# Altium project in3ator.PrjPcb
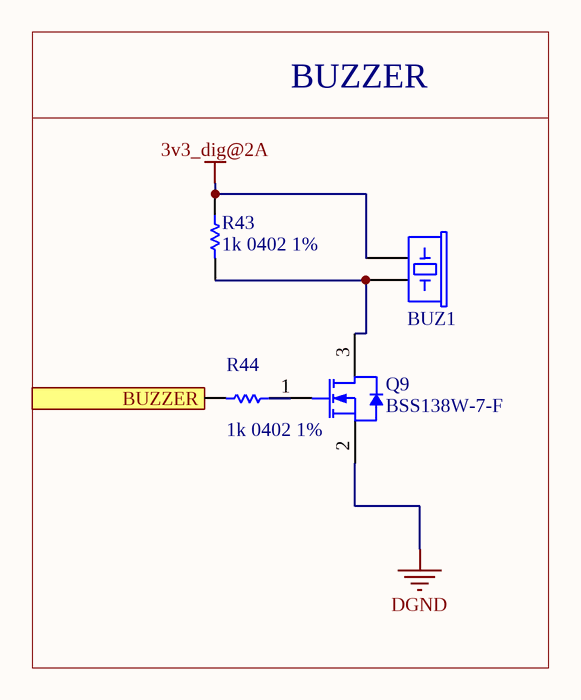
[diagram p0: Buzzer.SchDoc]
Author_in3: Pablo Sanchez Bergasa; SheetTotal_in3: 10
2 sheets, 25 parts. Net scope: flat (ports and power ports of the same name join across sheets).
Board file: Motherboard.PcbDoc
Sheets:
  Buzzer.SchDoc
  Sensors.SchDoc

## Sheet Buzzer.SchDoc: Buzzer
size A4; SheetNumber: 8; SheetTotal: 11

### Parts
BUZ1  CUI CMT-1285C-035  [BUZZER-12MM-NS]  (value not drawn)
Q9  BSS138W-7-F  [DIOD-SOT323-3_V]
R43  1k 0402 1%  [RESC1005X40X25ML05T10]
R44  1k 0402 1%  [RESC1005X40X25ML05T10]

### Blocks framed on the sheet
BUZZER: BUZ1 Q9 R43 R44

### Ports
BUZZER (in)

### Nets
3v3_dig@2A: BUZ1.1(+) R43.1
DGND: Q9.2(S)
NetBUZ1_2: BUZ1.2(-) Q9.3(D) R43.2
NetQ9_1: Q9.1(G) R44.1
NetR44_2: R44.2 ; port BUZZER

### Notes on the sheet
- Title
- Size:
- Date:
- A3
- Author:
- Time:
- Revision:
- Sheet
- of
- File:

### Library data of the parts
BUZ1 = CMP-581a9557be5887dd-1: Audio Buzzer Magnetic 3Vo-p 5Vo-p 70mA 3.5Vo-p 85dB Through Hole Pin Tray; Lead-Free Status: Lead Free; Octopart URL: https://octopart.com/cmt-1285c-035-cui-71811876; Manufacturer Part Number: CMT-1285C-035; Mounting Style: Through Hole; RoHS: Compliant; OctopartID: 581a9557be5887dd; Manufacturer Part Number 2: GMC1205YA-16R2048; LCSC_PN: C252915
Q9 = CMP-2000-05968-1: N-Channel Enhancement Mode Mosfet, 50 V, 200 mA, -55 to 150 degC, 6-Pin SOT-323, RoHS, Tape and Reel; Typical Turn-Off Delay Time: 20ns; Number of Channels: 1Channel; Type: EnhancementModeFieldEffectTransistor; Brand: DiodesIncorporated; Vds - Drain-Source Breakdown Voltage: 75V; Vgs - Gate-Source Voltage: 20V; Rds On - Drain-Source Resistance: 1.4Ohms; Transistor Type: 1N-Channel; Configuration: Single; Unit Weight: 0.000212oz; Pd - Power Dissipation: 200mW; Id - Continuous Drain Current: 200mA; Forward Transconductance - Min: 0.1S; Manufacturer URL: http://www.diodes.com/; Series: BSS138; Package Description: 3-Pin Small Outline Transistor, Body 2 x 1.25 mm, Pitch 0.65 mm; Mounting Technology: SurfaceMount; Product Category: MOSFET; RoHS: True; Maximum Operating Temperature: +150C; Height: 1mm; Length: 2.2mm; Technology: Si; Width: 1.35mm; Datasheet URL: http://www.diodes.com/_files/datasheets/ds30206.pdf; Manufacturer: DiodesIncorporated; Package / Case: SOT-323-3; Typical Turn-On Delay Time: 20ns; Transistor Polarity: N-Channel; Factory Pack Quantity: 3000; Packaging: Reel; Product: MOSFETSmallSignal; Datasheet Version: Rev. 11-2, 09/2013; Package Reference: SOT323; Minimum Operating Temperature: -55C; Mounting Style: SMD/SMT; Channel Mode: Enhancement; LCSC_PN: C24553
R43 R44 = CMP-2002-07472-1: LCSC_PN: C106235

## Sheet Sensors.SchDoc: Sensors
size A3; SheetNumber: 10; SheetTotal: 10
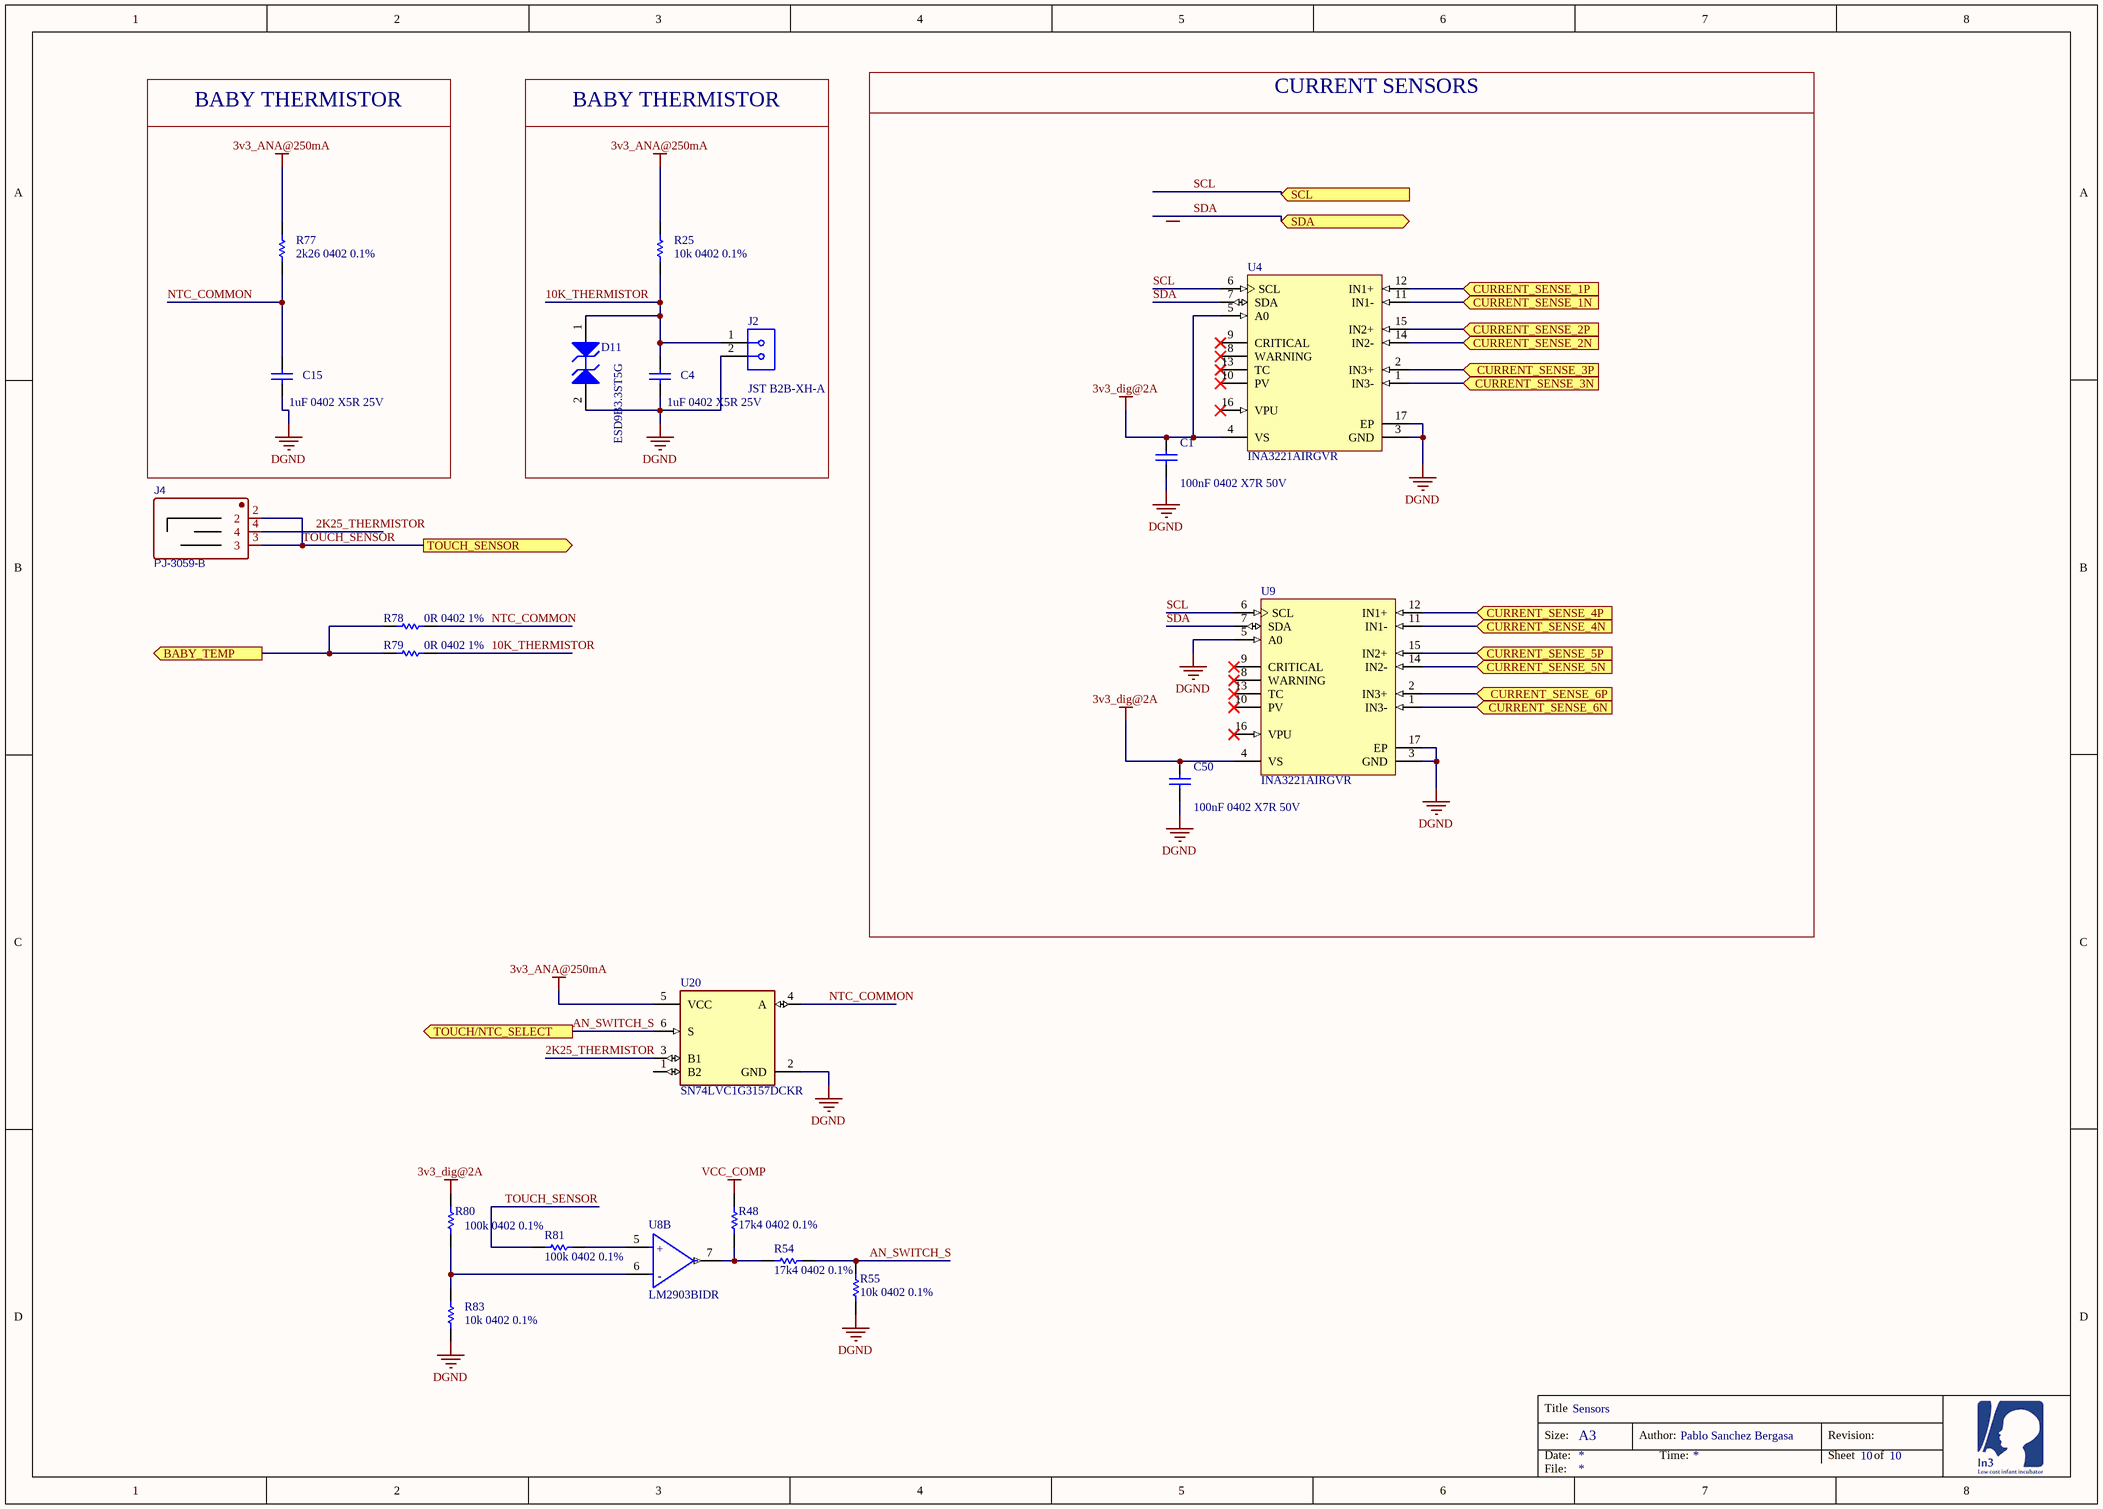
[diagram p1: Sensors.SchDoc]

### Parts
C1  100nF 0402 X7R 50V  [CAPC1005X55X25NL5T10]
C4  1uF 0402 X5R 25V  [CAPC1005X55X25NL5T10]
C15  1uF 0402 X5R 25V  [CAPC1005X55X25NL5T10]
C50  100nF 0402 X7R 50V  [CAPC1005X55X25NL5T10]
D11  ESD9B3.3ST5G  [ONSC-SOD-923-2-514AB-01_V]
J2  JST B2B-XH-A  [PCB-pp1at3pfx7vls1ur72ey-1]
J4  PJ-3059-B  [PJ-3059-B]
R25  10k 0402 0.1%  [RESC1005X40X25ML05T10]
R48  17k4 0402 0.1%  [RESC1005X40X25ML05T10]
R54  17k4 0402 0.1%  [RESC1005X40X25ML05T10]
R55  10k 0402 0.1%  [RESC1005X40X25ML05T10]
R77  2k26 0402 0.1%  [RESC1005X40X25ML05T10]
R78  0R 0402 1%  [RESC1005X40X25ML05T10]
R79  0R 0402 1%  [RESC1005X40X25ML05T10]
R80  100k 0402 0.1%  [RESC1005X40X25ML05T10]
R81  100k 0402 0.1%  [RESC1005X40X25ML05T10]
R83  10k 0402 0.1%  [RESC1005X40X25ML05T10]
U4  INA3221AIRGVR  [RGV0016A_V]
U8  LM2903BIDR  [FP-D0008A-MFG]  (part B of 2)
U9  INA3221AIRGVR  [RGV0016A_V]
U20  SN74LVC1G3157DCKR  [FP-DCK0006A-IPC_B]

### Blocks framed on the sheet
BABY THERMISTOR: C15 R77
BABY THERMISTOR: C4 D11 J2 R25
CURRENT SENSORS: C1 C50 U4 U9

### Ports
BABY_TEMP (out), CURRENT_SENSE_1N (in), CURRENT_SENSE_1P (in), CURRENT_SENSE_2N (in), CURRENT_SENSE_2P (in), CURRENT_SENSE_3N (in), CURRENT_SENSE_3P (in), CURRENT_SENSE_4N (in), CURRENT_SENSE_4P (in), CURRENT_SENSE_5N (in), CURRENT_SENSE_5P (in), CURRENT_SENSE_6N (in), CURRENT_SENSE_6P (in), SCL (in), SDA (bidir), TOUCH/NTC_SELECT (out), TOUCH_SENSOR (out)

### Nets
3v3_ANA@250mA: R25.2 R77.2 U20.5(VCC)
3v3_dig@2A: C1.2 C50.2 R80.2 U4.4(VS) U4.5(A0) U9.4(VS)
DGND: C1.1 C4.1 C15.1 C50.1 D11.2(A2) J2.2 R55.2 R83.1 U4.3(GND) U4.17(EP) U9.3(GND) U9.5(A0) U9.17(EP) U20.2(GND)
VCC_COMP: R48.2
2K25_THERMISTOR: J4.4 U20.3(B1)
10K_THERMISTOR: C4.2 D11.1(A1) J2.1 R25.1 R79.1
AN_SWITCH_S: R54.2 R55.1 U20.6(S) ; port TOUCH/NTC_SELECT
NTC_COMMON: C15.2 R77.1 R78.1 U20.4(A)
SCL: U4.6(SCL) U9.6(SCL) ; port SCL
SDA: U4.7(SDA) U9.7(SDA) ; port SDA
TOUCH_SENSOR: J4.2 J4.3 R81.2 ; port TOUCH_SENSOR
NetR48_1: R48.1 R54.1 U8.7(2OUT)
NetR78_2: R78.2 R79.2 ; port BABY_TEMP
NetR80_1: R80.1 R83.2 U8.6(2IN-)
NetR81_1: R81.1 U8.5(2IN+)
NetU4_1: U4.1(IN3-) ; port CURRENT_SENSE_3N
NetU4_2: U4.2(IN3+) ; port CURRENT_SENSE_3P
NetU4_11: U4.11(IN1-) ; port CURRENT_SENSE_1N
NetU4_12: U4.12(IN1+) ; port CURRENT_SENSE_1P
NetU4_14: U4.14(IN2-) ; port CURRENT_SENSE_2N
NetU4_15: U4.15(IN2+) ; port CURRENT_SENSE_2P
NetU9_1: U9.1(IN3-) ; port CURRENT_SENSE_6N
NetU9_2: U9.2(IN3+) ; port CURRENT_SENSE_6P
NetU9_11: U9.11(IN1-) ; port CURRENT_SENSE_4N
NetU9_12: U9.12(IN1+) ; port CURRENT_SENSE_4P
NetU9_14: U9.14(IN2-) ; port CURRENT_SENSE_5N
NetU9_15: U9.15(IN2+) ; port CURRENT_SENSE_5P

Not connected (* = marked no-connect by the designer): U4 8(WARNING)* 9(CRITICAL)* 10(PV)* 13(TC)* 16(VPU)*; U9 8(WARNING)* 9(CRITICAL)* 10(PV)* 13(TC)* 16(VPU)*; U20 1(B2)

### Notes on the sheet
- Title
- Size:
- Date:
- A3
- Author:
- Time:
- Revision:
- Sheet
- of
- File:
- (in symbol CMP-04896-000007-1, part B) +; -

### Library data of the parts
C1 C4 C15 C50 = CMP-1662-00020-1: ComponentLink2Description: Datasheet; ComponentLink2URL: http://psearch.en.murata.com/capacitor/product/GRM155R60J105KE19%23.pdf; ComponentLink1Description: Manufacturer URL; ComponentLink1URL: http://www.murata.com/
  C1 C50: LCSC_PN: C77020
  C4 C15: LCSC_PN: C77009
D11 = CMP-1063-00120-1: Transient Voltage Suppressor, Micro-Packaged Diode for ESD Protection, 2-Pin SOD-923, Pb-Free, Tape and Reel; Manufacturer: On Semiconductor; Number of Lines: 1; V(BR) Min (V): 5; VRWM Max (V): 3.3; Direction: Bidirectional; ComponentLink3URL: http://www.onsemi.com/pub_link/Collateral/514AB.PDF; PartNumber: ESD9B3.3ST5G; PackageVersion: Rev. C, 03/2011; Mounting Technology: Surface Mount; PackageReference: SOD-923-2-514AB-01; RoHS: Pb-Free; DatasheetVersion: Rev. 2; ComponentLink1URL: http://www.onsemi.com/; PackageDescription: 2-Pin SOD, Body 0.8 x 0.6 mm; ComponentLink3Description: Package Specification; ComponentLink2URL: http://www.onsemi.cn/pub_link/Collateral/ESD9B-D.PDF; IR Max (uA): 1; Packing: Tape and Reel; ComponentLink2Description: Datasheet; ComponentLink1Description: Manufacturer URL; LCSC_PN: C96512
J2 = CMP-1d67d451da9ec2a0-3: Conn Shrouded Header HDR 2 POS 2.5mm Solder ST Thru-Hole Box; Contact Material: Phosphor Bronze; OctopartID: 1d67d451da9ec2a0; Orientation: Straight; Octopart URL: https://octopart.com/b2b-xh-a-jst-3990175; Manufacturer Part Number: B2B-XH-A; LCSC Part: C158012; LCSC_PN: C158012
R25 R48 R54 R55 R77-R81 R83 = CMP-2002-07472-1
  R25 R55 R83: LCSC_PN: C190095
  R48 R54: LCSC_PN: C851231
  R77: LCSC_PN: C852697
  R78 R79: LCSC_PN: C60485
  R80 R81: LCSC_PN: C60491
U4 U9 = CMP-0704-00001-2: Triple Channel Shunt and Bus Voltage Monitor, 120 dB, 2.7 to 5.5 V, -40 to 125 degC, 16-Pin VQFN (RGV), Green (RoHS & no Sb/Br), Tape and Reel; Manufacturer: Texas Instruments; Rating: Catalog; Quiescent Current (Typ): 350 uA; Gain Error (max): 0.25%; CMR (Typ): 120 dB; Offset Voltage (max): +/- 80 uV; Gain: 1 V/V; Voltage Input Range (Bus): 0 to 26 V; ComponentLink2Description: Datasheet; PackageDescription: 16-Pin Quad Flat No-lead Package, Body 4 x 4 mm, Pitch 0.65 mm; ComponentLink3URL: http://www.ti.com/lit/ds/symlink/ina3221.pdf; PartNumber: INA3221AIRGVR; Operating Supply Range: 2.7 to 5.5 V; DatasheetVersion: SBOS576A; Temperature Range: -40 to 125 degC; ComponentLink1Description: Manufacturer URL; ComponentLink1URL: http://www.ti.com/; RoHS: TRUE; ComponentLink3Description: Package Specification; Packing: Tape and Reel; Mounting Technology: Surface Mount; ComponentLink2URL: http://www.ti.com/lit/ds/symlink/ina3221.pdf; PackageVersion: SBOS576A; PackageReference: RGV0016A; LCSC_PN: C181255
U8 = CMP-04896-000007-1: 36V JI.3 DUAL COMPARATOR; Manufacturer: Texas Instruments; Input Bias Current: -0.0035uA; Standoff Height: 0.11mm; Output Current Per Channel: 25mA; Response Time: 1us; Input Offset Voltage: 4mV; Number Of Channels: 2; Min Supply Voltage: 3V; Nominal Supply Current: 400-550uA; Max Junction Temp: +150°C; Max Supply Voltage: 36V; Height: 1.75mm; Ambient Temperature Range High: +125°C; Lead Free: Yes; Package: D0008A; Octopart: https://octopart.com/lm2903bidr-texas+instruments-104977165; Temperature Range High: +125°C; Device Class L1: Integrated Circuits (ICs); Ambient Temperature Range Low: -40°C; Temperature: -40°C to +125°C; Manufacturer Part Number: LM2903BIDR; Device Class L3: Comparators; Temperature Range Low: -40°C; Category: IC; ComponentLink2Description: Datasheet; ComponentLink2URL: http://www.ti.com/lit/ds/symlink/lm2903b.pdf; RoHS: TRUE; Device Class L2: Linear ICs; Digikey Description: 36V JI.3 DUAL COMPARATOR; Automotive: No; LCSC_PN: C2869804
U20 = CMP-0859-00516-4: IC SWITCH SPDT SC70-6; Nominal Supply Current: 10uA; Number of Inputs: 1; Supply Type: Single; Operating Supply Current: 1uA; Polarity: Non-Inverting; Low Level Output Current: 128mA; Bandwidth: 300MHz; Max Supply Voltage: 5.5V; Turn-Off Delay Time: 3.8ns; Turn-On Delay Time: 5.7ns; Number of Outputs: 2; Min Supply Voltage: 1.65V; Propagation Delay: 300ps; On-State Resistance: 15R; Mount: Surface Mount; Throw Configuration: SPDT; Min Operating Temperature: -40°C; Radiation Hardening: No; Number of Pins: 6; Case/Package: SC; Length: 2mm; Lead Free: Lead Free; REACH SVHC: No SVHC; Termination: SMD/SMT; High Level Output Current: 128mA; Height: 0.9mm; Weight: 8.8E-05oz; Package Quantity: 3000; Number of Channels: 1; Packaging: Tape and Reel; Number of Bits: 1; Width: 1.25mm; Max Operating Temperature: 125°C; Max Supply Current: 10uA; Contact Plating: Gold; RoHS Compliant: Yes; LCSC_PN: C38663
J4 = PJ-3059-B: LCSC_PN: C2884976

## Nets that join several sheets
3v3_dig@2A: Buzzer (BUZ1.1 R43.1), Sensors (6 pins)
DGND: Buzzer (Q9.2), Sensors (14 pins)

## Assembly variants
Main: not fitted C9 C10 C13 C33 C51 D8 J2 J5 J? L1 L2 L3 R3 R7 R8 R9 R41 R48 R56 R58 R61 R63 R71 R? R? R? R? R? SW1 U8 U12 U13
NO_AFE: not fitted C9 C10 C13 C33 C54 C55 C56 C57 C58 C59 C60 C61 D28 D29 D31 D32 J14 R58 R59 R60 R61 R62 R65 R66 R67 R68 R69 R71 R79 U17 Y1